# Altium schematic sheet Top.SchDoc
size B; DocumentNumber: 1; SheetNumber: 1; SheetTotal: 3; PageSetup: Record=PageOptions|CenterHorizontal=True|CenterVertical=True|PrintScale=1.00|XCorrection=1.00|YCorrection=1.00|PrintKind=1|BorderSize=5000000|LeftOffset=0|BottomOffset=0|Orientation=2|PaperLength=1000|PaperWidth=1000|Scale=100|PaperSource=257|PrintQuality=-3|MediaType=1|DitherType=10|PrintScaleMode=0|PaperKind=Letter|PaperIndex=1
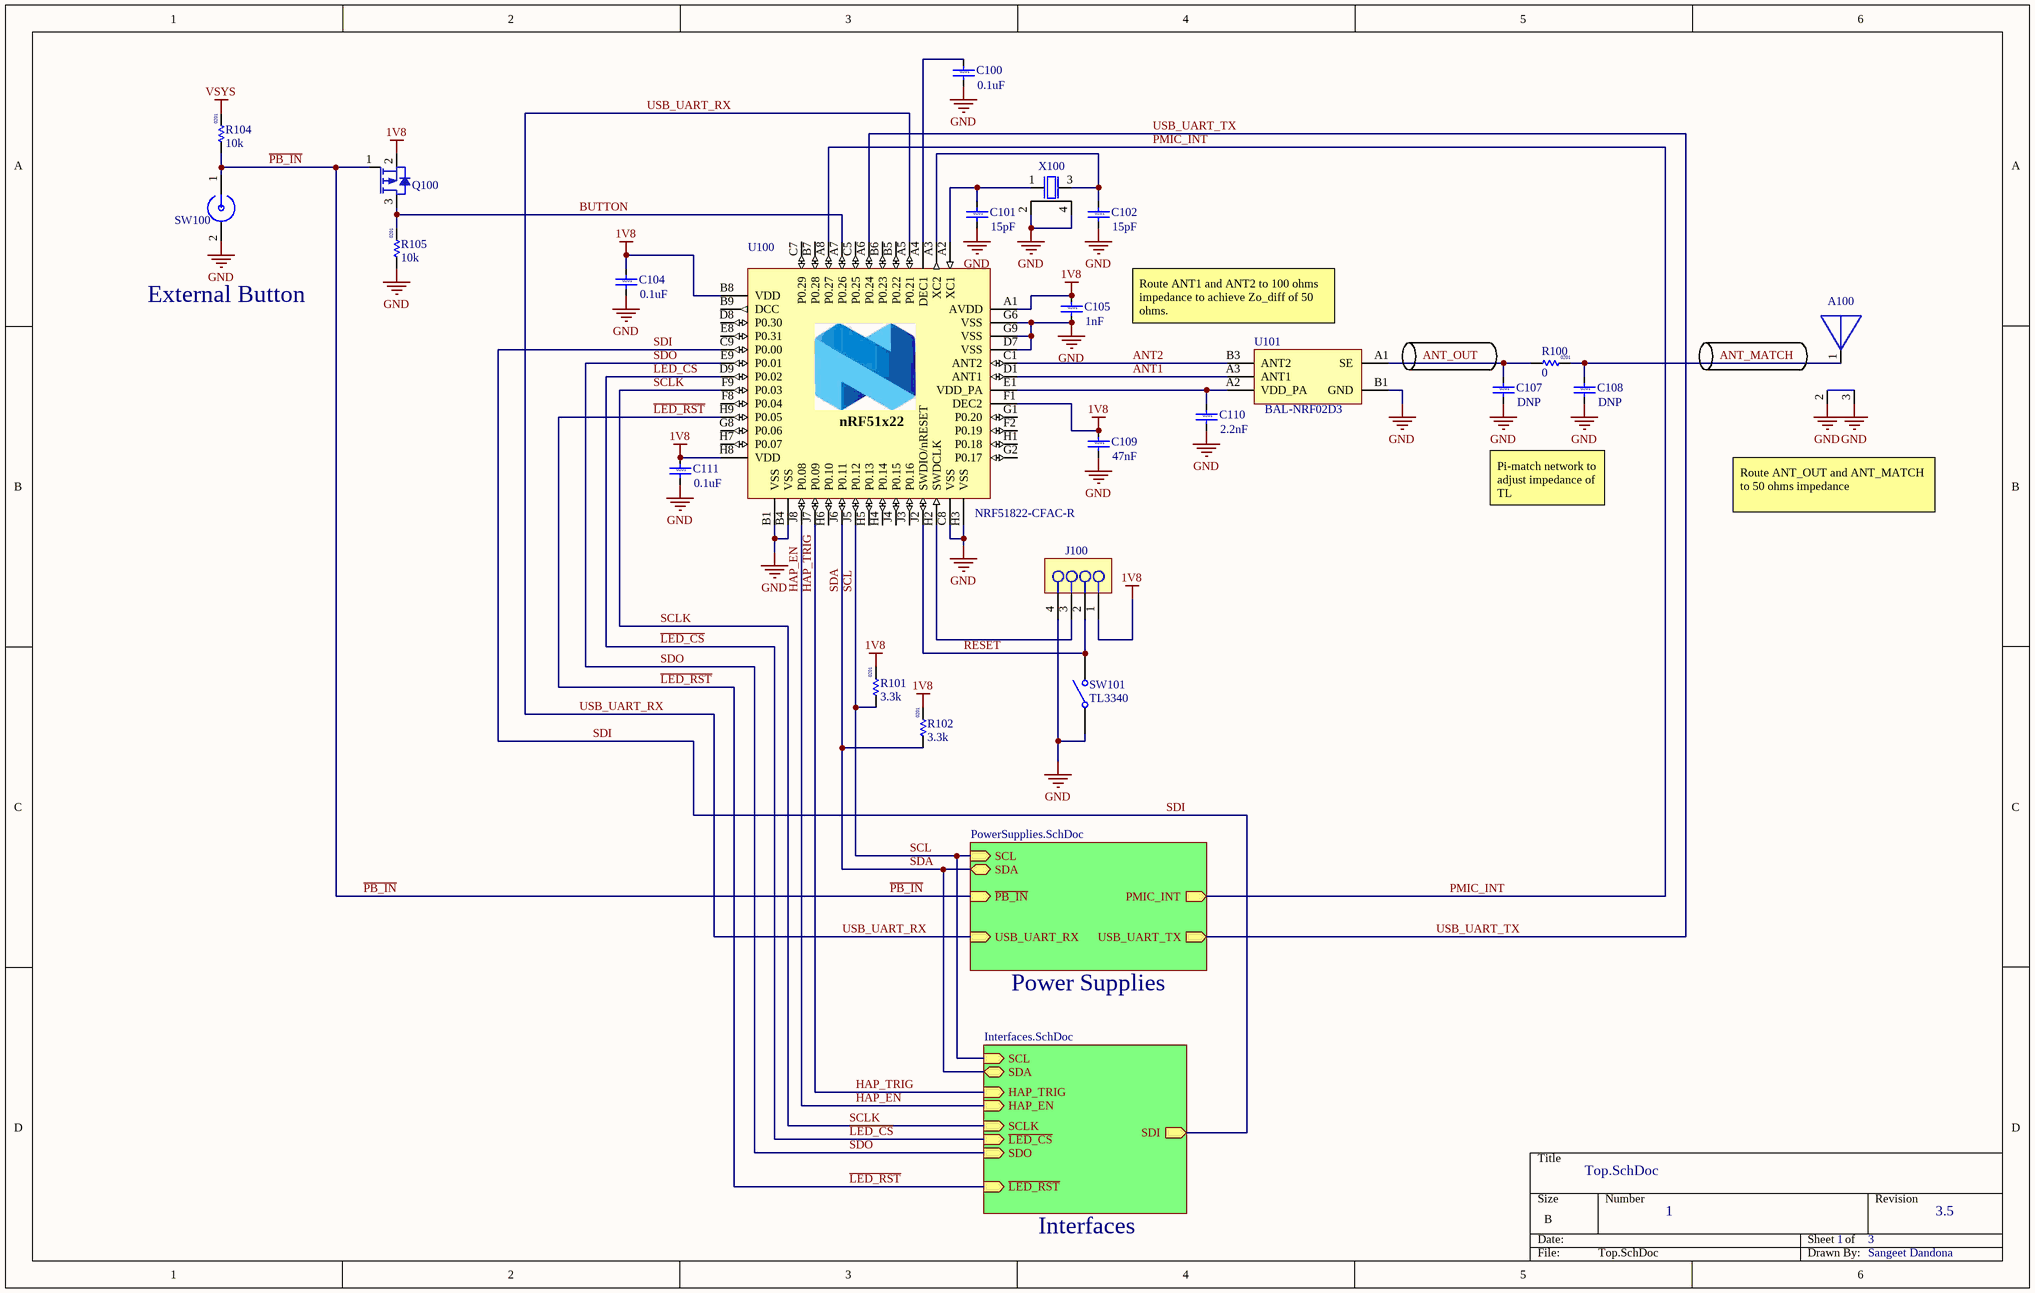
[diagram p0: Top.SchDoc]

## Parts
A100  (no value)  [2450AT07A0100]
C100  value 0.1uF  Size: 0201  [Cap 0201 HD]
C101  value 15pF  Size: 0201  [Cap 0201 HD]
C102  value 15pF  Size: 0201  [Cap 0201 HD]
C104  value 0.1uF  Size: 0201  [Cap 0201 HD]
C105  value 1nF  Size: 0201  [Cap 0201 HD]
C107  value DNP  Size: 0201  [Cap 0201 HD]
C108  value DNP  Size: 0201  [Cap 0201 HD]
C109  value 47nF  Size: 0201  [Cap 0201 HD]
C110  value 2.2nF  Size: 0201  [Cap 0201 HD]
C111  value 0.1uF  Size: 0201  [Cap 0201 HD]
J100  (no value)  [TP10R_1.27P-4Pin]
Q100  (no value)  [SOT-723]
R100  value 0  Size: 0201  [RES 0201 HD]
R101  value 3.3k  Size: 0201  [RES 0201 HD]
R102  value 3.3k  Size: 0201  [RES 0201 HD]
R104  value 10k  Size: 0201  [RES 0201 HD]
R105  value 10k  Size: 0201  [RES 0201 HD]
SW100  (no value)  [GX05170]
SW101  TL3340  [TL3340]
U100  MFPN: NRF51822-CFAC-R  [CFAC_WLCSP]
U101  (no value)  [BGA0.4P2x3-5Pin]
X100  (no value)  [XTAL_ABM11-16]

## Sub-sheets
Interfaces = Interfaces.SchDoc: SDA (bidir), SCL (in), SDO (in), ~{LED_CS} (in), ~{LED_RST} (in), SCLK (in), HAP_EN (in), HAP_TRIG (in), SDI (out)
Power Supplies = PowerSupplies.SchDoc: SCL (in), SDA (bidir), PMIC_INT (out), ~{PB_IN} (in), USB_UART_RX (in), USB_UART_TX (out)

## Nets
1V8: C104.1 C105.1 C109.1 C111.1 J100.1 Q100.2(S) R101.2 R102.2 U100.A1(AVDD) U100.B8(VDD) U100.F1(DEC2) U100.H8(VDD)
GND: A100.2 A100.3 C100.2 C101.2 C102.2 C104.2 C105.2 C107.2 C108.2 C109.2 C110.2 C111.2 J100.4 R105.1 SW100.2 SW101.1(COMMON) U100.B1(VSS) U100.B4(VSS) U100.C8(VSS) U100.D7(VSS) U100.G3(N.C.) U100.G4(N.C.) U100.G6(VSS) U100.G9(VSS) U100.H3(VSS) U101.B1(GND) X100.2 X100.4
VSYS: R104.2
~{LED_CS}: U100.D9(P0.02) ; sheet Interfaces/~{LED_CS}
~{LED_RST}: U100.H9(P0.05) ; sheet Interfaces/~{LED_RST}
~{PB_IN}: Q100.1(G) R104.1 SW100.1 ; sheet Power Supplies/~{PB_IN}
~{RESET}: J100.2 SW101.2(NO) U100.J2(SWDIO/nRESET)
ANT1: U100.D1(ANT1) U101.A3(ANT1)
ANT2: U100.C1(ANT2) U101.B3(ANT2)
ANT_MATCH: A100.1 C108.1 R100.2
ANT_OUT: C107.1 R100.1 U101.A1(SE)
BUTTON: Q100.3(D) R105.2 U100.A7(P0.26)
HAP_EN: U100.J8(P0.08) ; sheet Interfaces/HAP_EN
HAP_TRIG: U100.J7(P0.09) ; sheet Interfaces/HAP_TRIG
PMIC_INT: U100.A8(P0.27) ; sheet Power Supplies/PMIC_INT
SCL: R101.1 U100.J5(P0.12) ; sheet Interfaces/SCL, sheet Power Supplies/SCL
SCLK: U100.F9(P0.03) ; sheet Interfaces/SCLK
SDA: R102.1 U100.J6(P0.11) ; sheet Interfaces/SDA, sheet Power Supplies/SDA
SDI: U100.C9(P0.00) ; sheet Interfaces/SDI
SDO: U100.E9(P0.01) ; sheet Interfaces/SDO
USB_UART_RX: U100.A5(P0.21) ; sheet Power Supplies/USB_UART_RX
USB_UART_TX: U100.A6(P0.24) ; sheet Power Supplies/USB_UART_TX
NetC100_1: C100.1 U100.A4(DEC1)
NetC101_1: C101.1 U100.A2(XC1) X100.1
NetC102_1: C102.1 U100.A3(XC2) X100.3
NetC110_1: C110.1 U100.E1(VDD_PA) U101.A2(VDD_PA)
NetJ100_3: J100.3 U100.H2(SWDCLK)

Not connected (* = marked no-connect by the designer): U100 B5(P0.22) B6(P0.23) B7(P0.28) B9(DCC) C5(P0.25) C6(N.C.) C7(P0.29) D8(P0.30) E2(N.C.) E3(N.C.) E7(N.C.) E8(P0.31) F2(P0.19) F3(N.C.) F7(N.C.) F8(P0.04) G1(P0.20) G2(P0.17) G5(N.C.) G7(N.C.) G8(P0.06) H1(P0.18) H4(P0.14) H5(P0.13) H6(P0.10) H7(P0.07) J3(P0.16) J4(P0.15)

## Notes on the sheet
- External Button
- Route ANT1 and ANT2 to 100 ohms impedance to achieve Zo_diff of 50 ohms.
- Pi-match network to adjust impedance of TL
- Route ANT_OUT and ANT_MATCH to 50 ohms impedance
- 3.5
- Sangeet Dandona
- (in symbol nRF51822-CFAC) nRF51x22

## Library data of the parts
A100 = 2450AT07A0100: ANTENNA SMD EIA 0402 2.4GHZ; MF: Johanson Technology Inc.; MFPN: 2450AT07A0100T; Size: 1mmx0.5mm; Height: 0.37mm; Cost: 0.36562
C100 C104 C111 = Cap 0201 0.1uF 6.3V: CAP CER 0.1UF 6.3V 10% X5R 0201; MF: Murata Electronics North America; MFPN: GRM033R60J104KE19D; Cost: 0.00650
C101 C102 = Cap 0201 11pF 25V: CAP CER 15PF 25V NP0 0201; MF: Murata Electronics North America; MFPN: GRM0335C1E150FA01D; Cost: 0.00900
C105 = Cap 0201 1nF 25V: CAP CER 1000PF 25V 10% X7R 0201; MF: Murata Electronics North America; MFPN: GRM033R71E102KA01D; Cost: 0.00500
C107 C108 = Cap 0201 Generic: Capacitor, Ceramic 0201, DNP; Cost: 0; MF: N/A; MFPN: DNP
C109 = Cap 0201 47nF 10V: CAP CER 0.047UF 10V 10% X5R 0201; MF: Taiyo Yuden; MFPN: LMK063BJ473KP-F; Cost: 0.02325
C110 = Cap 0201 2.2nF 16V: CAP CER 2200PF 16V 10% X7R 0201; MF: Murata Electronics North America; MFPN: GRM033R71C222KA88D; Cost: 0.00525
J100 = SWD_Pogo_TP: Test points for 4-wire Serial Wire Debugger header Pogo Pin harness, DNP; Size: 4.8mm x 1mm; Cost: 0; MF: N/A; MFPN: DNP
Q100 = MOSFET-P: MOSFET P-CH 20V 0.1A VMT3; MF: Rohm Semiconductor; MFPN: RZM001P02T2L; Size: 1.2mm x 0.8mm; Package: SOT-723; Cost: 0.03792; Type: MOSFET-P
R100 = Res 0201 0R Jumper: RES SMD 0.0OHM JUMPER 1/20W 0201; MF: Samsung Electro-Mechanics America, Inc.; MFPN: RC0603J000CS; Cost: 0.00787
R101 R102 = Res 0201 3.3k 5%: RES SMD 3.3K OHM 5% 1/20W 0201; MF: Samsung Electro-Mechanics America, Inc.; MFPN: RC0603J332CS; Cost: 0.00583
R104 R105 = Res 0201 10k 5%: RES SMD 10K OHM 5% 1/20W 0201; MF: Rohm Semiconductor; MFPN: MCR006YRTJ103; Cost: 0.00594
SW100 = GX05170: Snap Dome, high activation force, 5.3mm dia; MF: Snaptron; Size: 5.3mm dia; Cost: 0; MFPN: GX05170
SW101 = TL3340: SWITCH TACTILE SPST-NO 0.05A 12V; MF: E-Switch; MFPN: TL3340AF160QG; Size: 4.00mm x 3.30mm; Cost: 0.30030
U100 = nRF51822-CFAC: IC SOC 2.4GHZ MULTIPROTO 62WLCS; MF: Nordic Semiconductor ASA; Cost: 2.52225
U101 = BAL-NRF02D3: IC BALUN FOR NRF51822 WLCSP; MF: STMicroelectronics; Size: 1.435mmx.905mm; Cost: 0.20300; MFPN: BAL-NRF02D3
X100 = XTAL_ABM11-16: CRYSTAL 16.0000MHZ 10PF SMD; MF: Abracon LLC; MFPN: ABM11-16.000MHZ-B7G-T; Size: 2.0mm x 1.6mm; Cost: 0.75600